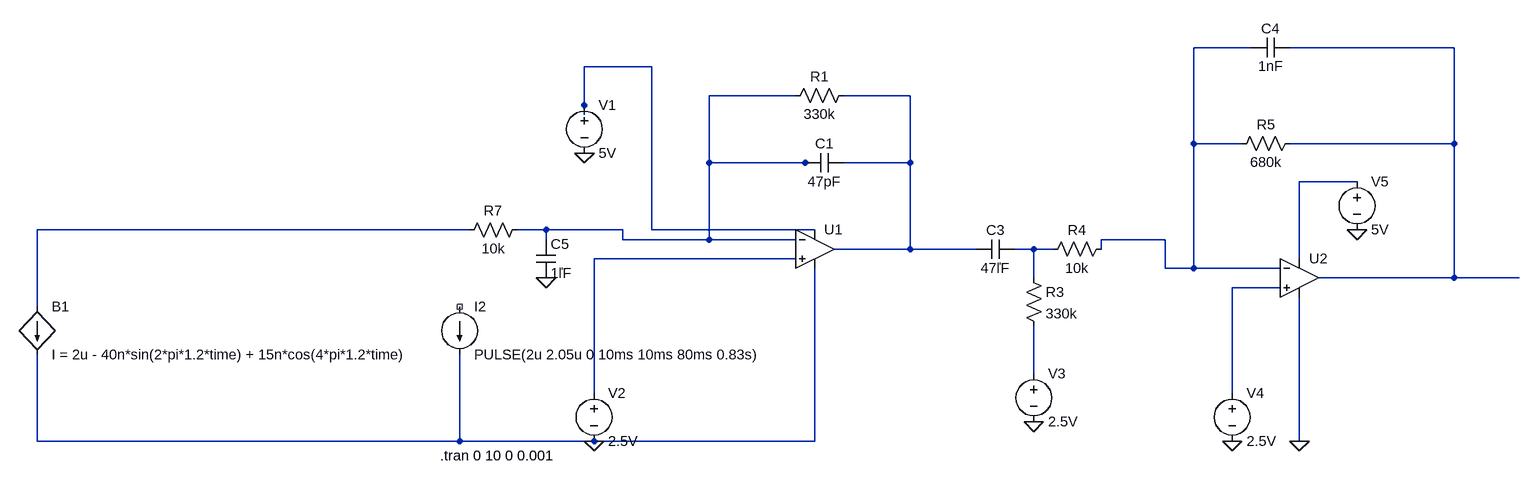
[diagram p0: schematic heartrate.asc]
heartrate.asc, the LTspice schematic file:
Version 4.1
SHEET 1 4040 680
WIRE 1968 -544 1872 -544
WIRE 2464 -544 2032 -544
WIRE -160 -512 -272 -512
WIRE 80 -464 -64 -464
WIRE 304 -464 160 -464
WIRE -272 -448 -272 -512
WIRE -272 -432 -272 -448
WIRE 1872 -384 1872 -544
WIRE 1952 -384 1872 -384
WIRE 2464 -384 2464 -544
WIRE 2464 -384 2032 -384
WIRE -64 -352 -64 -464
WIRE 96 -352 -64 -352
WIRE 112 -352 96 -352
WIRE 304 -352 304 -464
WIRE 304 -352 160 -352
WIRE 2144 -320 2048 -320
WIRE -464 -240 -1184 -240
WIRE -336 -240 -384 -240
WIRE -208 -240 -336 -240
WIRE -160 -240 -160 -512
WIRE 112 -240 -160 -240
WIRE -336 -224 -336 -240
WIRE -208 -224 -208 -240
WIRE -64 -224 -64 -352
WIRE -64 -224 -208 -224
WIRE 80 -224 -64 -224
WIRE 1824 -224 944 -224
WIRE 304 -208 304 -352
WIRE 304 -208 144 -208
WIRE 736 -208 304 -208
WIRE 832 -208 800 -208
WIRE 864 -208 832 -208
WIRE 944 -208 944 -224
WIRE 80 -192 -256 -192
WIRE 2048 -192 2048 -320
WIRE 1824 -176 1824 -224
WIRE 1872 -176 1872 -384
WIRE 1872 -176 1824 -176
WIRE 2016 -176 1872 -176
WIRE 832 -160 832 -208
WIRE 2464 -160 2464 -384
WIRE 2464 -160 2080 -160
WIRE 2624 -160 2464 -160
WIRE 2016 -144 1936 -144
WIRE -1184 -112 -1184 -240
WIRE 832 0 832 -80
WIRE -256 32 -256 -192
WIRE 1936 32 1936 -144
WIRE -1184 112 -1184 -32
WIRE -480 112 -480 -32
WIRE -480 112 -1184 112
WIRE -256 112 -480 112
WIRE 112 112 112 -176
WIRE 112 112 -256 112
WIRE 2048 112 2048 -128
FLAG -256 112 0
FLAG -272 -368 0
FLAG 832 80 0
FLAG 1936 112 0
FLAG 2144 -240 0
FLAG 2048 112 0
FLAG -336 -160 0
SYMBOL voltage -272 -464 R0
SYMATTR InstName V1
SYMATTR Value 5V
SYMBOL voltage -256 16 R0
SYMATTR InstName V2
SYMATTR Value 2.5V
SYMBOL OpAmps\\UniversalOpAmp2 112 -208 R0
SYMATTR InstName U1
SYMBOL res 176 -480 R90
WINDOW 0 0 56 VBottom 2
WINDOW 3 32 56 VTop 2
SYMATTR InstName R1
SYMATTR Value 330k
SYMBOL cap 160 -368 R90
WINDOW 0 0 32 VBottom 2
WINDOW 3 32 32 VTop 2
SYMATTR InstName C1
SYMATTR Value 47pF
SYMBOL cap 800 -224 R90
WINDOW 0 0 32 VBottom 2
WINDOW 3 32 32 VTop 2
SYMATTR InstName C3
SYMATTR Value 47ľF
SYMBOL res 960 -224 R90
WINDOW 0 0 56 VBottom 2
WINDOW 3 32 56 VTop 2
SYMATTR InstName R4
SYMATTR Value 10k
SYMATTR SpiceLine tol=1 pwr=0.1
SYMBOL res 816 -176 R0
SYMATTR InstName R3
SYMATTR Value 330k
SYMBOL voltage 832 -16 R0
WINDOW 123 0 0 Left 0
WINDOW 39 0 0 Left 0
SYMATTR InstName V3
SYMATTR Value 2.5V
SYMBOL OpAmps\\UniversalOpAmp2 2048 -160 R0
SYMATTR InstName U2
SYMBOL voltage 1936 16 R0
SYMATTR InstName V4
SYMATTR Value 2.5V
SYMBOL res 2048 -400 R90
WINDOW 0 0 56 VBottom 2
WINDOW 3 32 56 VTop 2
SYMATTR InstName R5
SYMATTR Value 680k
SYMBOL cap 2032 -560 R90
WINDOW 0 0 32 VBottom 2
WINDOW 3 32 32 VTop 2
SYMATTR InstName C4
SYMATTR Value 1nF
SYMBOL voltage 2144 -336 R0
SYMATTR InstName V5
SYMATTR Value 5V
SYMBOL res -368 -256 R90
WINDOW 0 0 56 VBottom 2
WINDOW 3 32 56 VTop 2
SYMATTR InstName R7
SYMATTR Value 10k
SYMBOL cap -352 -224 R0
SYMATTR InstName C5
SYMATTR Value 1ľF
SYMBOL current -480 -112 R0
WINDOW 123 24 28 Left 2
WINDOW 39 0 0 Left 0
SYMATTR InstName I2
SYMATTR Value PULSE(2u 2.05u 0 10ms 10ms 80ms 0.83s)
SYMBOL bi -1184 -112 R0
SYMATTR InstName B1
SYMATTR Value I = 2u - 40n*sin(2*pi*1.2*time) + 15n*cos(4*pi*1.2*time)
TEXT -512 136 Left 2 !.tran 0 10 0 0.001

The netlist it stands for:
* heartrate.asc
V1 N003 0 5V
V2 N009 0 2.5V
X§U1 N009 N004 N003 0 N005 level2 Avol=1Meg GBW=10Meg Slew=10Meg Ilimit=25m Rail=0 Vos=0 En=0 Enk=0 In=0 Ink=0 Rin=500Meg  ; pins In+ In- V+ V- OUT
R1 N005 N004 330k
C1 N005 N004 47pF
C3 N008 N005 47ľF
R4 N001 N008 10k tol=1 pwr=0.1
R3 N008 N011 330k
V3 N011 0 2.5V
X§U2 N010 N001 N006 0 N002 level2 Avol=1Meg GBW=10Meg Slew=10Meg Ilimit=25m Rail=0 Vos=0 En=0 Enk=0 In=0 Ink=0 Rin=500Meg  ; pins In+ In- V+ V- OUT
V4 N010 0 2.5V
R5 N002 N001 680k
C4 N002 N001 1nF
V5 N006 0 5V
R7 N004 N007 10k
C5 N004 0 1ľF
I2 NC_01 0 PULSE(2u 2.05u 0 10ms 10ms 80ms 0.83s)
B1 N007 0 I = 2u - 40n*sin(2*pi*1.2*time) + 15n*cos(4*pi*1.2*time)
.tran 0 10 0 0.001
.lib UniversalOpAmp2.lib
.backanno
.end